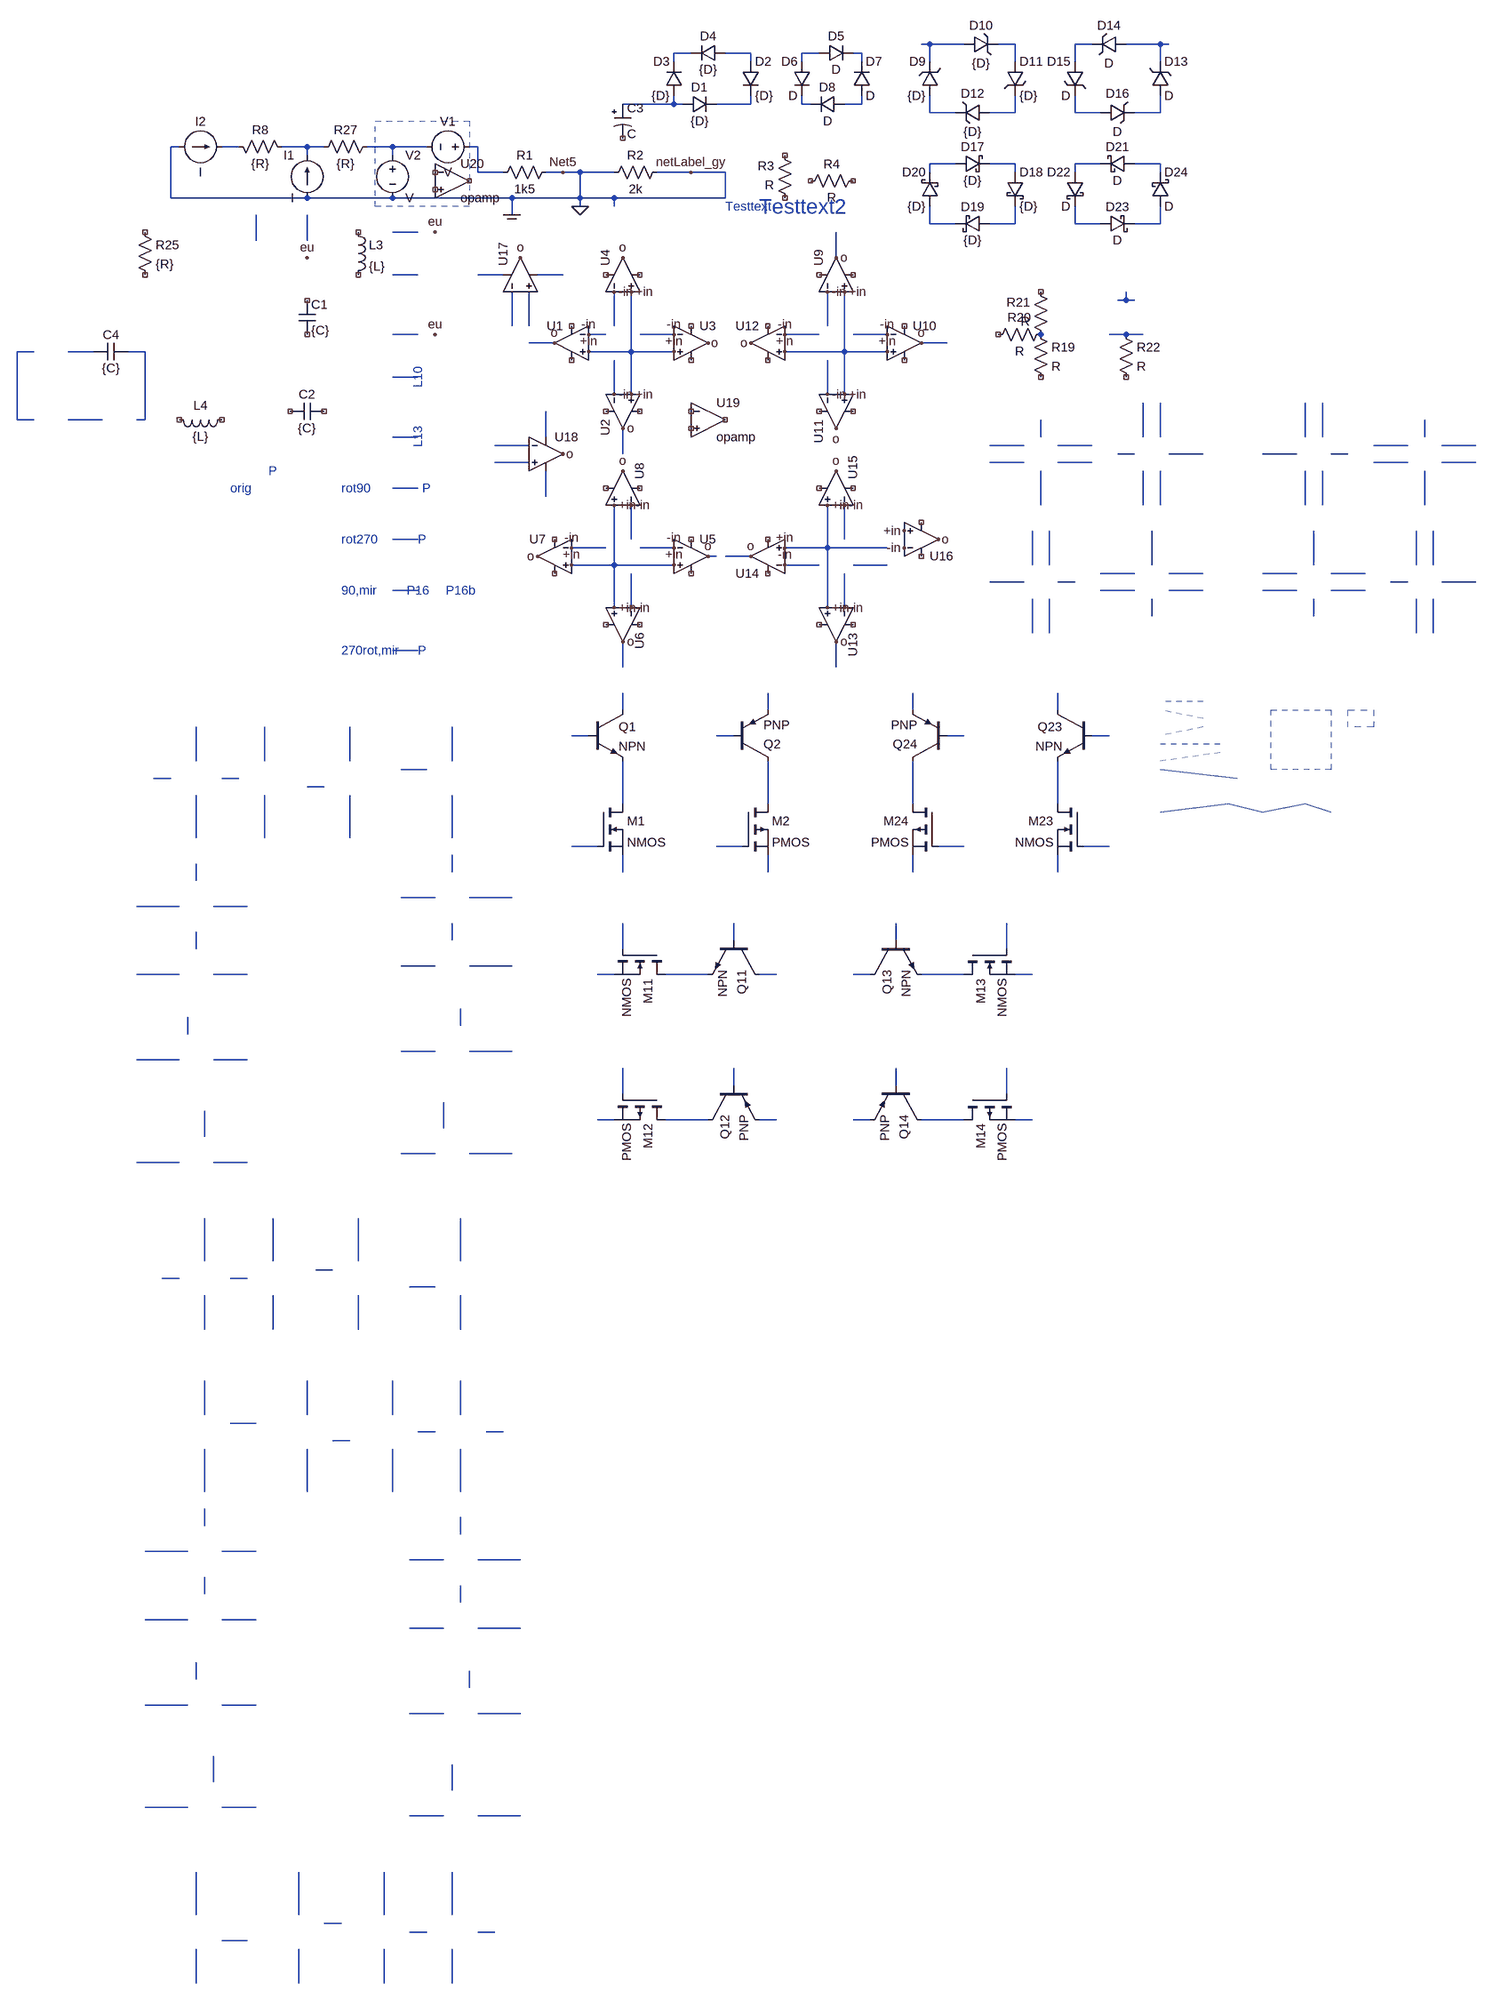
[diagram p0: schematic test2.asc]
test2.asc, the LTspice schematic file:
Version 4
SHEET 1 1908 3588
WIRE 880 -128 864 -128
WIRE 944 -128 880 -128
WIRE 1040 -128 1008 -128
WIRE 1184 -128 1152 -128
WIRE 1312 -128 1248 -128
WIRE 1328 -128 1312 -128
WIRE 432 -112 400 -112
WIRE 544 -112 496 -112
WIRE 672 -112 640 -112
WIRE 752 -112 736 -112
WIRE 400 -96 400 -112
WIRE 544 -96 544 -112
WIRE 640 -96 640 -112
WIRE 752 -96 752 -112
WIRE 880 -96 880 -128
WIRE 1040 -96 1040 -128
WIRE 1152 -96 1152 -128
WIRE 1312 -96 1312 -128
WIRE 400 -16 400 -32
WIRE 400 -16 304 -16
WIRE 416 -16 400 -16
WIRE 544 -16 544 -32
WIRE 544 -16 480 -16
WIRE 640 -16 640 -32
WIRE 656 -16 640 -16
WIRE 752 -16 752 -32
WIRE 752 -16 720 -16
WIRE 880 0 880 -32
WIRE 928 0 880 0
WIRE 1040 0 1040 -32
WIRE 1040 0 992 0
WIRE 1152 0 1152 -32
WIRE 1200 0 1152 0
WIRE 1312 0 1312 -32
WIRE 1312 0 1264 0
WIRE -528 64 -544 64
WIRE -416 64 -448 64
WIRE -288 64 -336 64
WIRE -256 64 -288 64
WIRE -128 64 -176 64
WIRE -64 64 -128 64
WIRE 32 64 16 64
WIRE -288 80 -288 64
WIRE -128 80 -128 64
WIRE 928 96 880 96
WIRE 1040 96 992 96
WIRE 1200 96 1152 96
WIRE 1312 96 1264 96
WIRE 32 112 32 64
WIRE 80 112 32 112
WIRE 192 112 160 112
WIRE 224 112 192 112
WIRE 288 112 224 112
WIRE 432 112 368 112
WIRE 496 112 432 112
WIRE 880 112 880 96
WIRE 1040 112 1040 96
WIRE 1152 112 1152 96
WIRE 1312 112 1312 96
WIRE -544 160 -544 64
WIRE -288 160 -544 160
WIRE -128 160 -288 160
WIRE 96 160 -128 160
WIRE 224 160 224 112
WIRE 224 160 96 160
WIRE 288 160 224 160
WIRE 496 160 496 112
WIRE 496 160 288 160
WIRE 224 176 224 160
WIRE 288 176 288 160
WIRE 96 192 96 160
WIRE 880 208 880 176
WIRE 928 208 880 208
WIRE 1040 208 1040 176
WIRE 1040 208 992 208
WIRE 1152 208 1152 176
WIRE 1200 208 1152 208
WIRE 1312 208 1312 176
WIRE 1312 208 1264 208
WIRE -80 224 -128 224
WIRE -384 240 -384 192
WIRE -288 240 -288 192
WIRE 704 272 704 224
WIRE -80 304 -128 304
WIRE 80 304 32 304
WIRE 192 304 144 304
WIRE 1248 352 1248 336
WIRE 1248 352 1232 352
WIRE 1264 352 1248 352
WIRE 96 400 96 336
WIRE 128 400 128 336
WIRE 288 400 288 336
WIRE 688 400 688 336
WIRE -80 416 -128 416
WIRE 272 416 240 416
WIRE 400 416 336 416
WIRE 672 416 608 416
WIRE 800 416 736 416
WIRE 1248 416 1216 416
WIRE 1280 416 1248 416
WIRE 176 432 128 432
WIRE 912 432 864 432
WIRE -800 448 -832 448
WIRE -688 448 -736 448
WIRE -592 448 -624 448
WIRE 320 448 320 336
WIRE 320 448 240 448
WIRE 400 448 320 448
WIRE 720 448 720 336
WIRE 720 448 608 448
WIRE 800 448 720 448
WIRE -80 496 -128 496
WIRE 288 528 288 464
WIRE 320 528 320 448
WIRE 688 528 688 464
WIRE 720 528 720 448
WIRE -832 576 -832 448
WIRE -800 576 -832 576
WIRE -672 576 -736 576
WIRE -592 576 -592 448
WIRE -592 576 -608 576
WIRE -80 608 -128 608
WIRE 160 608 160 560
WIRE 1088 608 1088 576
WIRE 1280 608 1280 544
WIRE 1312 608 1312 544
WIRE 1584 608 1584 544
WIRE 1616 608 1616 544
WIRE 1808 608 1808 576
WIRE 128 624 64 624
WIRE 1056 624 992 624
WIRE 1184 624 1120 624
WIRE 1776 624 1712 624
WIRE 1904 624 1840 624
WIRE 304 640 304 592
WIRE 1264 640 1232 640
WIRE 1392 640 1328 640
WIRE 1568 640 1504 640
WIRE 1664 640 1632 640
WIRE 128 656 64 656
WIRE 1056 656 992 656
WIRE 1184 656 1120 656
WIRE 1776 656 1712 656
WIRE 1904 656 1840 656
WIRE -80 704 -128 704
WIRE 160 720 160 672
WIRE 1088 736 1088 672
WIRE 1280 736 1280 672
WIRE 1312 736 1312 672
WIRE 1584 736 1584 672
WIRE 1616 736 1616 672
WIRE 1808 736 1808 672
WIRE -80 800 -128 800
WIRE 320 800 320 736
WIRE 720 800 720 736
WIRE 272 816 208 816
WIRE 400 816 336 816
WIRE 688 816 688 736
WIRE 688 816 608 816
WIRE 800 816 688 816
WIRE 480 832 464 832
WIRE 544 832 496 832
WIRE 288 848 288 736
WIRE 288 848 208 848
WIRE 400 848 288 848
WIRE 672 848 608 848
WIRE 800 848 736 848
WIRE 1072 848 1072 784
WIRE 1104 848 1104 784
WIRE 1296 848 1296 784
WIRE 1600 848 1600 784
WIRE 1792 848 1792 784
WIRE 1824 848 1824 784
WIRE 1264 864 1200 864
WIRE 1392 864 1328 864
WIRE 1568 864 1504 864
WIRE 1696 864 1632 864
WIRE 1056 880 992 880
WIRE 1152 880 1120 880
WIRE 1776 880 1744 880
WIRE 1904 880 1840 880
WIRE -80 896 -128 896
WIRE 1264 896 1200 896
WIRE 1392 896 1328 896
WIRE 1568 896 1504 896
WIRE 1696 896 1632 896
WIRE 288 928 288 848
WIRE 320 928 320 864
WIRE 688 928 688 816
WIRE 720 928 720 864
WIRE 1296 944 1296 912
WIRE 1600 944 1600 912
WIRE 1072 976 1072 912
WIRE 1104 976 1104 912
WIRE 1792 976 1792 912
WIRE 1824 976 1824 912
WIRE -80 1008 -128 1008
WIRE 304 1040 304 992
WIRE 704 1040 704 992
WIRE 304 1120 304 1088
WIRE 576 1120 576 1088
WIRE 848 1120 848 1088
WIRE 1120 1120 1120 1088
WIRE 240 1168 208 1168
WIRE 512 1168 480 1168
WIRE 944 1168 912 1168
WIRE 1216 1168 1184 1168
WIRE -496 1216 -496 1152
WIRE -368 1216 -368 1152
WIRE -208 1216 -208 1152
WIRE -16 1216 -16 1152
WIRE -64 1232 -112 1232
WIRE -544 1248 -576 1248
WIRE -416 1248 -448 1248
WIRE -256 1264 -288 1264
WIRE 304 1296 304 1216
WIRE 576 1296 576 1216
WIRE 848 1296 848 1216
WIRE 1120 1296 1120 1216
WIRE -496 1360 -496 1280
WIRE -368 1360 -368 1280
WIRE -208 1360 -208 1280
WIRE -16 1360 -16 1280
WIRE 256 1376 208 1376
WIRE 528 1376 480 1376
WIRE 944 1376 896 1376
WIRE 1216 1376 1168 1376
WIRE -16 1424 -16 1392
WIRE 304 1424 304 1392
WIRE 576 1424 576 1392
WIRE 848 1424 848 1392
WIRE 1120 1424 1120 1392
WIRE -496 1440 -496 1408
WIRE -48 1472 -112 1472
WIRE 96 1472 16 1472
WIRE -528 1488 -608 1488
WIRE -400 1488 -464 1488
WIRE -16 1552 -16 1520
WIRE 512 1552 512 1520
WIRE 816 1552 816 1520
WIRE -496 1568 -496 1536
WIRE 304 1568 304 1520
WIRE 1024 1568 1024 1520
WIRE -48 1600 -112 1600
WIRE 96 1600 16 1600
WIRE -528 1616 -608 1616
WIRE -400 1616 -464 1616
WIRE 288 1616 256 1616
WIRE 464 1616 384 1616
WIRE 592 1616 560 1616
WIRE 768 1616 736 1616
WIRE 944 1616 864 1616
WIRE 1072 1616 1040 1616
WIRE 0 1712 0 1680
WIRE -512 1728 -512 1696
WIRE -48 1760 -112 1760
WIRE 96 1760 16 1760
WIRE -528 1776 -608 1776
WIRE -400 1776 -464 1776
WIRE 512 1824 512 1792
WIRE 816 1824 816 1792
WIRE 304 1840 304 1792
WIRE 1024 1840 1024 1792
WIRE 288 1888 256 1888
WIRE 464 1888 384 1888
WIRE 592 1888 560 1888
WIRE 768 1888 736 1888
WIRE 944 1888 864 1888
WIRE 1072 1888 1040 1888
WIRE -32 1904 -32 1856
WIRE -480 1920 -480 1872
WIRE -48 1952 -112 1952
WIRE 96 1952 16 1952
WIRE -528 1968 -608 1968
WIRE -400 1968 -464 1968
WIRE -480 2192 -480 2112
WIRE -352 2192 -352 2112
WIRE -192 2192 -192 2112
WIRE 0 2192 0 2112
WIRE -240 2208 -272 2208
WIRE -528 2224 -560 2224
WIRE -400 2224 -432 2224
WIRE -48 2240 -96 2240
WIRE -480 2320 -480 2256
WIRE -352 2320 -352 2256
WIRE -192 2320 -192 2256
WIRE 0 2320 0 2256
WIRE -480 2480 -480 2416
WIRE -288 2480 -288 2416
WIRE -128 2480 -128 2416
WIRE 0 2480 0 2416
WIRE -384 2496 -432 2496
WIRE -48 2512 -80 2512
WIRE 80 2512 48 2512
WIRE -208 2528 -240 2528
WIRE -480 2624 -480 2544
WIRE -288 2624 -288 2544
WIRE -128 2624 -128 2544
WIRE 0 2624 0 2544
WIRE -480 2688 -480 2656
WIRE 0 2704 0 2672
WIRE -512 2736 -592 2736
WIRE -384 2736 -448 2736
WIRE -32 2752 -96 2752
WIRE 112 2752 32 2752
WIRE -480 2816 -480 2784
WIRE 0 2832 0 2800
WIRE -512 2864 -592 2864
WIRE -384 2864 -448 2864
WIRE -32 2880 -96 2880
WIRE 112 2880 32 2880
WIRE -496 2976 -496 2944
WIRE 16 2992 16 2960
WIRE -512 3024 -592 3024
WIRE -384 3024 -448 3024
WIRE -32 3040 -96 3040
WIRE 112 3040 32 3040
WIRE -464 3168 -464 3120
WIRE -16 3184 -16 3136
WIRE -512 3216 -592 3216
WIRE -384 3216 -448 3216
WIRE -32 3232 -96 3232
WIRE 112 3232 32 3232
WIRE -496 3456 -496 3376
WIRE -304 3456 -304 3376
WIRE -144 3456 -144 3376
WIRE -16 3456 -16 3376
WIRE -224 3472 -256 3472
WIRE -64 3488 -96 3488
WIRE 64 3488 32 3488
WIRE -400 3504 -448 3504
WIRE -496 3584 -496 3520
WIRE -304 3584 -304 3520
WIRE -144 3584 -144 3520
WIRE -16 3584 -16 3520
FLAG 224 176 0
FLAG -48 224 eu
FLAG 176 432 o
FLAG 240 416 -in
FLAG 240 448 +in
FLAG 304 592 o
FLAG 288 528 -in
FLAG 320 528 +in
FLAG -48 416 eu
FLAG -288 272 eu
FLAG 464 432 o
FLAG 400 416 -in
FLAG 400 448 +in
FLAG 304 272 o
FLAG 288 336 -in
FLAG 320 336 +in
FLAG 464 832 o
FLAG 400 816 -in
FLAG 400 848 +in
FLAG 304 992 o
FLAG 320 928 -in
FLAG 288 928 +in
FLAG 144 832 o
FLAG 208 816 -in
FLAG 208 848 +in
FLAG 304 672 o
FLAG 320 736 -in
FLAG 288 736 +in
FLAG 704 272 o
FLAG 688 336 -in
FLAG 720 336 +in
FLAG 864 432 o
FLAG 800 416 -in
FLAG 800 448 +in
FLAG 704 592 o
FLAG 688 528 -in
FLAG 720 528 +in
FLAG 544 432 o
FLAG 608 416 -in
FLAG 608 448 +in
FLAG 704 992 o
FLAG 720 928 -in
FLAG 688 928 +in
FLAG 544 832 o
FLAG 608 848 -in
FLAG 608 816 +in
FLAG 704 672 o
FLAG 720 736 -in
FLAG 688 736 +in
FLAG 896 800 o
FLAG 832 816 -in
FLAG 832 784 +in
FLAG 96 192 COM
FLAG 112 272 o
FLAG 192 640 o
FLAG 432 112 netLabel_gy
FLAG 192 112 Net5
SYMBOL res 64 128 R270
WINDOW 0 32 56 VTop 2
WINDOW 3 0 56 VBottom 2
SYMATTR InstName R1
SYMATTR Value 1k5
SYMATTR Value2 v=U1
SYMBOL res 384 96 R90
WINDOW 0 0 56 VBottom 2
WINDOW 3 32 56 VTop 2
SYMATTR InstName R2
SYMATTR Value 2k
SYMBOL res 624 176 R180
WINDOW 0 36 76 Left 2
WINDOW 3 36 40 Left 2
SYMATTR InstName R3
SYMBOL res 752 112 R90
WINDOW 0 0 56 VBottom 2
WINDOW 3 32 56 VTop 2
SYMATTR InstName R4
SYMBOL voltage 32 64 R90
WINDOW 0 -32 56 VBottom 2
WINDOW 3 32 56 VTop 2
SYMATTR InstName V1
SYMBOL voltage -128 64 R0
SYMATTR InstName V2
SYMBOL Opamps\\UniversalOpamp2 208 432 M0
SYMATTR InstName U1
SYMBOL Opamps\\UniversalOpamp2 304 560 M90
SYMATTR InstName U2
SYMBOL current -288 160 R180
WINDOW 0 24 80 Left 2
WINDOW 3 24 0 Left 2
SYMATTR InstName I1
SYMBOL current -528 64 R270
WINDOW 0 32 40 VTop 2
WINDOW 3 -32 40 VBottom 2
SYMATTR InstName I2
SYMBOL res -432 48 M90
WINDOW 0 0 56 VBottom 2
WINDOW 3 32 56 VTop 2
SYMATTR InstName R8
SYMATTR Value {R}
SYMATTR Value2 v={$U_{R_8}$},i=$I_1$
SYMBOL Opamps\\UniversalOpamp2 432 432 R0
SYMATTR InstName U3
SYMBOL Opamps\\UniversalOpamp2 304 304 R270
SYMATTR InstName U4
SYMBOL Opamps\\UniversalOpamp2 432 832 R0
SYMATTR InstName U5
SYMBOL Opamps\\UniversalOpamp2 304 960 R90
SYMATTR InstName U6
SYMBOL Opamps\\UniversalOpamp2 176 832 M0
SYMATTR InstName U7
SYMBOL Opamps\\UniversalOpamp2 304 704 M270
SYMATTR InstName U8
SYMBOL Opamps\\UniversalOpamp2 704 304 R270
SYMATTR InstName U9
SYMBOL Opamps\\UniversalOpamp2 832 432 R0
SYMATTR InstName U10
SYMBOL Opamps\\UniversalOpamp2 704 560 M90
SYMATTR InstName U11
SYMBOL Opamps\\UniversalOpamp2 576 432 M0
SYMATTR InstName U12
SYMBOL Opamps\\UniversalOpamp2 704 960 R90
SYMATTR InstName U13
SYMBOL Opamps\\UniversalOpamp2 576 832 R180
SYMATTR InstName U14
SYMBOL Opamps\\UniversalOpamp2 704 704 M270
SYMATTR InstName U15
SYMBOL Opamps\\UniversalOpamp2 864 800 M180
SYMATTR InstName U16
SYMBOL res 1072 400 R0
SYMATTR InstName R19
SYMBOL res 1104 400 R90
WINDOW 0 0 56 VBottom 2
WINDOW 3 32 56 VTop 2
SYMATTR InstName R20
SYMBOL res 1104 432 R180
WINDOW 0 36 76 Left 2
WINDOW 3 36 40 Left 2
SYMATTR InstName R21
SYMBOL res 1232 400 R0
SYMATTR InstName R22
SYMBOL res -608 208 R0
SYMATTR InstName R25
SYMATTR Value {R}
SYMBOL res -160 48 R90
WINDOW 0 0 56 VBottom 2
WINDOW 3 32 56 VTop 2
SYMATTR InstName R27
SYMATTR Value {R}
SYMBOL ind -208 208 R0
SYMATTR InstName L3
SYMATTR Value {L}
SYMBOL ind -432 560 R90
WINDOW 0 5 56 VBottom 2
WINDOW 3 32 56 VTop 2
SYMATTR InstName L4
SYMATTR Value {L}
SYMBOL cap -304 352 R0
SYMATTR InstName C1
SYMATTR Value {C}
SYMBOL cap -256 544 R90
WINDOW 0 0 32 VBottom 2
WINDOW 3 32 32 VTop 2
SYMATTR InstName C2
SYMATTR Value {C}
SYMBOL nmos 256 1296 R0
SYMATTR InstName M1
SYMBOL pmos 528 1296 R0
SYMATTR InstName M2
SYMBOL npn 240 1120 R0
SYMATTR InstName Q1
SYMBOL pnp 512 1216 M180
SYMATTR InstName Q2
SYMBOL diode 416 0 R270
WINDOW 0 32 32 VTop 2
WINDOW 3 0 32 VBottom 2
SYMATTR InstName D1
SYMATTR Value {D}
SYMBOL diode 528 -96 R0
SYMATTR InstName D2
SYMATTR Value {D}
SYMBOL diode 416 -32 R180
WINDOW 0 24 64 Left 2
WINDOW 3 24 0 Left 2
SYMATTR InstName D3
SYMATTR Value {D}
SYMBOL diode 496 -128 R90
WINDOW 0 0 32 VBottom 2
WINDOW 3 32 32 VTop 2
SYMATTR InstName D4
SYMATTR Value {D}
SYMBOL diode 672 -128 M90
WINDOW 0 0 32 VBottom 2
WINDOW 3 32 32 VTop 2
SYMATTR InstName D5
SYMBOL diode 656 -96 M0
SYMATTR InstName D6
SYMBOL diode 736 -32 M180
WINDOW 0 24 64 Left 2
WINDOW 3 24 0 Left 2
SYMATTR InstName D7
SYMBOL diode 720 0 M270
WINDOW 0 32 32 VTop 2
WINDOW 3 0 32 VBottom 2
SYMATTR InstName D8
SYMBOL zener 896 -32 R180
WINDOW 0 24 64 Left 2
WINDOW 3 24 0 Left 2
SYMATTR InstName D9
SYMATTR Value {D}
SYMBOL zener 944 -112 R270
WINDOW 0 36 32 VTop 2
WINDOW 3 -4 32 VBottom 2
SYMATTR InstName D10
SYMATTR Value {D}
SYMBOL zener 1024 -96 R0
SYMATTR InstName D11
SYMATTR Value {D}
SYMBOL zener 992 -16 R90
WINDOW 0 -4 32 VBottom 2
WINDOW 3 36 32 VTop 2
SYMATTR InstName D12
SYMATTR Value {D}
SYMBOL zener 1296 -32 M180
WINDOW 0 24 64 Left 2
WINDOW 3 24 0 Left 2
SYMATTR InstName D13
SYMBOL zener 1248 -112 M270
WINDOW 0 36 32 VTop 2
WINDOW 3 -4 32 VBottom 2
SYMATTR InstName D14
SYMBOL zener 1168 -96 M0
SYMATTR InstName D15
SYMBOL zener 1200 -16 M90
WINDOW 0 -4 32 VBottom 2
WINDOW 3 36 32 VTop 2
SYMATTR InstName D16
SYMBOL schottky 928 112 R270
WINDOW 0 32 32 VTop 2
WINDOW 3 0 32 VBottom 2
SYMATTR InstName D17
SYMATTR Value {D}
SYMBOL schottky 1024 112 R0
SYMATTR InstName D18
SYMATTR Value {D}
SYMBOL schottky 992 192 R90
WINDOW 0 0 32 VBottom 2
WINDOW 3 32 32 VTop 2
SYMATTR InstName D19
SYMATTR Value {D}
SYMBOL schottky 896 176 R180
WINDOW 0 24 64 Left 2
WINDOW 3 24 0 Left 2
SYMATTR InstName D20
SYMATTR Value {D}
SYMBOL schottky 1264 112 M270
WINDOW 0 32 32 VTop 2
WINDOW 3 0 32 VBottom 2
SYMATTR InstName D21
SYMBOL schottky 1168 112 M0
SYMATTR InstName D22
SYMBOL schottky 1200 192 M90
WINDOW 0 0 32 VBottom 2
WINDOW 3 32 32 VTop 2
SYMATTR InstName D23
SYMBOL schottky 1296 176 M180
WINDOW 0 24 64 Left 2
WINDOW 3 24 0 Left 2
SYMATTR InstName D24
SYMBOL Opamps\\UniversalOpamp2 112 304 R270
SYMATTR InstName U17
SYMBOL Opamps\\UniversalOpamp2 160 640 R0
SYMATTR InstName U18
SYMBOL nmos 384 1568 R90
SYMATTR InstName M11
SYMBOL pmos 384 1840 R90
SYMATTR InstName M12
SYMBOL npn 560 1552 R90
SYMATTR InstName Q11
SYMBOL pnp 464 1824 M90
SYMATTR InstName Q12
SYMBOL nmos 944 1568 M90
SYMATTR InstName M13
SYMBOL pmos 944 1840 M90
SYMATTR InstName M14
SYMBOL npn 768 1552 M90
SYMATTR InstName Q13
SYMBOL pnp 864 1824 R90
SYMATTR InstName Q14
SYMBOL nmos 1168 1296 M0
SYMATTR InstName M23
SYMBOL pmos 896 1296 M0
SYMATTR InstName M24
SYMBOL npn 1184 1120 M0
SYMATTR InstName Q23
SYMBOL pnp 912 1216 R180
SYMATTR InstName Q24
SYMBOL polcap 288 -16 R0
SYMATTR InstName C3
SYMBOL cap -688 464 R270
WINDOW 0 32 32 VTop 2
WINDOW 3 0 32 VBottom 2
SYMATTR InstName C4
SYMATTR Value {C}
SYMATTR Value2 v={1V},i=1A
SYMBOL OpAmps\\opamp 464 512 R0
SYMATTR InstName U19
SYMBOL OpAmps\\opamp -16 64 R0
SYMATTR InstName U20
TEXT -80 496 VCenter 2 ;L10
TEXT -80 608 VCenter 2 ;L13
TEXT -72 704 Left 2 ;P
TEXT -80 800 Left 2 ;P
TEXT -80 896 Center 2 ;P16
TEXT -80 1008 Left 2 ;P
TEXT -224 704 Left 2 ;rot90
TEXT -224 800 Left 2 ;rot270
TEXT -224 896 Left 2 ;90,mir
TEXT -224 1008 Left 2 ;270rot,mir
TEXT -352 672 Center 2 ;P
TEXT -432 704 Left 2 ;orig
TEXT 0 896 Center 2 ;P16b
TEXT 496 176 Left 2 ;Testtext
TEXT 560 176 Left 4 ;Testtext2
LINE Normal 1392 1104 1312 1104 2
LINE Normal 1392 1136 1312 1120 1
LINE Normal 1392 1152 1312 1168 2
LINE Normal 1424 1184 1312 1184 3
LINE Normal 1424 1200 1312 1216 4
LINE Normal 1456 1248 1312 1232
LINE Normal 1440 1296 1312 1312
LINE Normal 1504 1312 1440 1296
LINE Normal 1584 1296 1504 1312
LINE Normal 1632 1312 1584 1296
RECTANGLE Normal 1632 1232 1520 1120 2
RECTANGLE Normal 1712 1152 1664 1120 1
RECTANGLE Normal 16 176 -160 16 2

The netlist it stands for:
* test2.asc
R1 N020 0 1k5 v=U1
R2 0 0 2k
R3 NC_01 NC_02 R
R4 NC_03 NC_04 R
V1 N020 N019 V
V2 N019 0 V
XU1 +in -in NC_05 NC_06 o level.2 Avol=1Meg GBW=10Meg Slew=10Meg ilimit=25m rail=0 Vos=0 phimargin=45 en=0 enk=0 in=0 ink=0 Rin=500Meg  ; pins IN+ IN- V+ V- OUT
XU2 +in -in NC_07 NC_08 o level.2 Avol=1Meg GBW=10Meg Slew=10Meg ilimit=25m rail=0 Vos=0 phimargin=45 en=0 enk=0 in=0 ink=0 Rin=500Meg  ; pins IN+ IN- V+ V- OUT
I1 0 N018 I
I2 0 N017 I
R8 N017 N018 {R} v={$U_{R_8}$},i=$I_1$
XU3 +in -in NC_09 NC_10 o level.2 Avol=1Meg GBW=10Meg Slew=10Meg ilimit=25m rail=0 Vos=0 phimargin=45 en=0 enk=0 in=0 ink=0 Rin=500Meg  ; pins IN+ IN- V+ V- OUT
XU4 +in -in NC_11 NC_12 o level.2 Avol=1Meg GBW=10Meg Slew=10Meg ilimit=25m rail=0 Vos=0 phimargin=45 en=0 enk=0 in=0 ink=0 Rin=500Meg  ; pins IN+ IN- V+ V- OUT
XU5 +in -in NC_13 NC_14 o level.2 Avol=1Meg GBW=10Meg Slew=10Meg ilimit=25m rail=0 Vos=0 phimargin=45 en=0 enk=0 in=0 ink=0 Rin=500Meg  ; pins IN+ IN- V+ V- OUT
XU6 +in -in NC_15 NC_16 o level.2 Avol=1Meg GBW=10Meg Slew=10Meg ilimit=25m rail=0 Vos=0 phimargin=45 en=0 enk=0 in=0 ink=0 Rin=500Meg  ; pins IN+ IN- V+ V- OUT
XU7 +in -in NC_17 NC_18 o level.2 Avol=1Meg GBW=10Meg Slew=10Meg ilimit=25m rail=0 Vos=0 phimargin=45 en=0 enk=0 in=0 ink=0 Rin=500Meg  ; pins IN+ IN- V+ V- OUT
XU8 +in -in NC_19 NC_20 o level.2 Avol=1Meg GBW=10Meg Slew=10Meg ilimit=25m rail=0 Vos=0 phimargin=45 en=0 enk=0 in=0 ink=0 Rin=500Meg  ; pins IN+ IN- V+ V- OUT
XU9 +in -in NC_21 NC_22 o level.2 Avol=1Meg GBW=10Meg Slew=10Meg ilimit=25m rail=0 Vos=0 phimargin=45 en=0 enk=0 in=0 ink=0 Rin=500Meg  ; pins IN+ IN- V+ V- OUT
XU10 +in -in NC_23 NC_24 o level.2 Avol=1Meg GBW=10Meg Slew=10Meg ilimit=25m rail=0 Vos=0 phimargin=45 en=0 enk=0 in=0 ink=0 Rin=500Meg  ; pins IN+ IN- V+ V- OUT
XU11 +in -in NC_25 NC_26 o level.2 Avol=1Meg GBW=10Meg Slew=10Meg ilimit=25m rail=0 Vos=0 phimargin=45 en=0 enk=0 in=0 ink=0 Rin=500Meg  ; pins IN+ IN- V+ V- OUT
XU12 +in -in NC_27 NC_28 o level.2 Avol=1Meg GBW=10Meg Slew=10Meg ilimit=25m rail=0 Vos=0 phimargin=45 en=0 enk=0 in=0 ink=0 Rin=500Meg  ; pins IN+ IN- V+ V- OUT
XU13 +in -in NC_29 NC_30 o level.2 Avol=1Meg GBW=10Meg Slew=10Meg ilimit=25m rail=0 Vos=0 phimargin=45 en=0 enk=0 in=0 ink=0 Rin=500Meg  ; pins IN+ IN- V+ V- OUT
XU14 +in -in NC_31 NC_32 o level.2 Avol=1Meg GBW=10Meg Slew=10Meg ilimit=25m rail=0 Vos=0 phimargin=45 en=0 enk=0 in=0 ink=0 Rin=500Meg  ; pins IN+ IN- V+ V- OUT
XU15 +in -in NC_33 NC_34 o level.2 Avol=1Meg GBW=10Meg Slew=10Meg ilimit=25m rail=0 Vos=0 phimargin=45 en=0 enk=0 in=0 ink=0 Rin=500Meg  ; pins IN+ IN- V+ V- OUT
XU16 +in -in NC_35 NC_36 o level.2 Avol=1Meg GBW=10Meg Slew=10Meg ilimit=25m rail=0 Vos=0 phimargin=45 en=0 enk=0 in=0 ink=0 Rin=500Meg  ; pins IN+ IN- V+ V- OUT
R19 P001 NC_37 R
R20 P001 NC_38 R
R21 P001 NC_39 R
R22 N039 NC_40 R
R25 NC_41 NC_42 {R}
R27 N019 N018 {R}
L3 NC_43 NC_44 {L}
L4 NC_45 NC_46 {L}
C1 NC_47 NC_48 {C}
C2 NC_49 NC_50 {C}
M1 N119 N127 N132 N132 NMOS
M2 N120 N128 N133 N133 PMOS
Q1 N103 N107 N119 0 NPN
Q2 N120 N108 N104 0 PNP
D1 N009 N010 {D}
D2 N006 N010 {D}
D3 N009 N005 {D}
D4 N006 N005 {D}
D5 N007 N008 D
D6 N007 N011 D
D7 N012 N008 D
D8 N012 N011 D
D9 N013 N001 {D}
D10 N001 N002 {D}
D11 N002 N014 {D}
D12 N014 N013 {D}
D13 N016 N004 D
D14 N004 N003 D
D15 N003 N015 D
D16 N015 N016 D
D17 N021 N022 {D}
D18 N022 N026 {D}
D19 N026 N025 {D}
D20 N025 N021 {D}
D21 N024 N023 D
D22 N023 N027 D
D23 N027 N028 D
D24 N028 N024 D
XU17 N037 N036 N033 N034 o level.2 Avol=1Meg GBW=10Meg Slew=10Meg ilimit=25m rail=0 Vos=0 phimargin=45 en=0 enk=0 in=0 ink=0 Rin=500Meg  ; pins IN+ IN- V+ V- OUT
XU18 N062 N053 N046 N068 o level.2 Avol=1Meg GBW=10Meg Slew=10Meg ilimit=25m rail=0 Vos=0 phimargin=45 en=0 enk=0 in=0 ink=0 Rin=500Meg  ; pins IN+ IN- V+ V- OUT
M11 N152 N145 N151 N151 NMOS
M12 N168 N165 N167 N167 PMOS
Q11 N153 N142 N152 0 NPN
Q12 N168 N163 N169 0 PNP
M13 N155 N146 N156 N156 NMOS
M14 N171 N166 N172 N172 PMOS
Q13 N154 N143 N155 0 NPN
Q14 N171 N164 N170 0 PNP
M23 N122 N130 N135 N135 NMOS
M24 N121 N129 N134 N134 PMOS
Q23 N106 N110 N122 0 NPN
Q24 N121 N109 N105 0 PNP
C3 N009 NC_51 C
C4 N041 N042 {C} v={1V},i=1A
XU19 NC_52 NC_53 NC_54 opamp Aol=100K GBW=10Meg  ; pins invin noninvin out
XU20 NC_55 NC_56 NC_57 opamp Aol=100K GBW=10Meg  ; pins invin noninvin out
.model D D
.lib standard.dio
.model NPN NPN
.model PNP PNP
.lib standard.bjt
.model NMOS NMOS
.model PMOS PMOS
.lib standard.mos
* L10
* L13
* P
* P
* P16
* P
* rot90
* rot270
* 90,mir
* 270rot,mir
* P
* orig
* P16b
* Testtext
* Testtext2
.lib UniversalOpamps2.sub
.backanno
.end